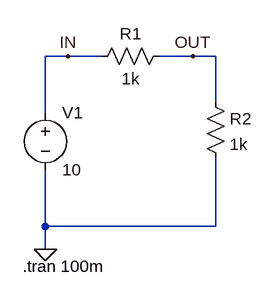
[diagram p0: schematic Assignment Simple Resistive Voltage Divider.asc]
Assignment Simple Resistive Voltage Divider.asc, the LTspice schematic file:
Version 4.1
SHEET 1 880 680
WIRE 16 128 -16 128
WIRE 64 128 16 128
WIRE 192 128 144 128
WIRE 224 128 192 128
WIRE 224 192 224 128
WIRE -16 208 -16 128
WIRE -16 368 -16 288
WIRE 224 368 224 272
WIRE 224 368 -16 368
WIRE -16 400 -16 368
FLAG -16 400 0
FLAG 16 128 IN
FLAG 192 128 OUT
SYMBOL res 160 112 R90
WINDOW 0 0 56 VBottom 2
WINDOW 3 32 56 VTop 2
SYMATTR InstName R1
SYMATTR Value 1k
SYMBOL res 208 176 R0
SYMATTR InstName R2
SYMATTR Value 1k
SYMBOL voltage -16 192 R0
WINDOW 123 0 0 Left 0
WINDOW 39 0 0 Left 0
SYMATTR InstName V1
SYMATTR Value 10
TEXT -48 424 Left 2 !.tran 100m

The netlist it stands for:
* Assignment Simple Resistive Voltage Divider.asc
R1 OUT IN 1k
R2 OUT 0 1k
V1 IN 0 10
.tran 100m
.backanno
.end